# Altium project MCU152A.PrjPcb (part 1 of 3)
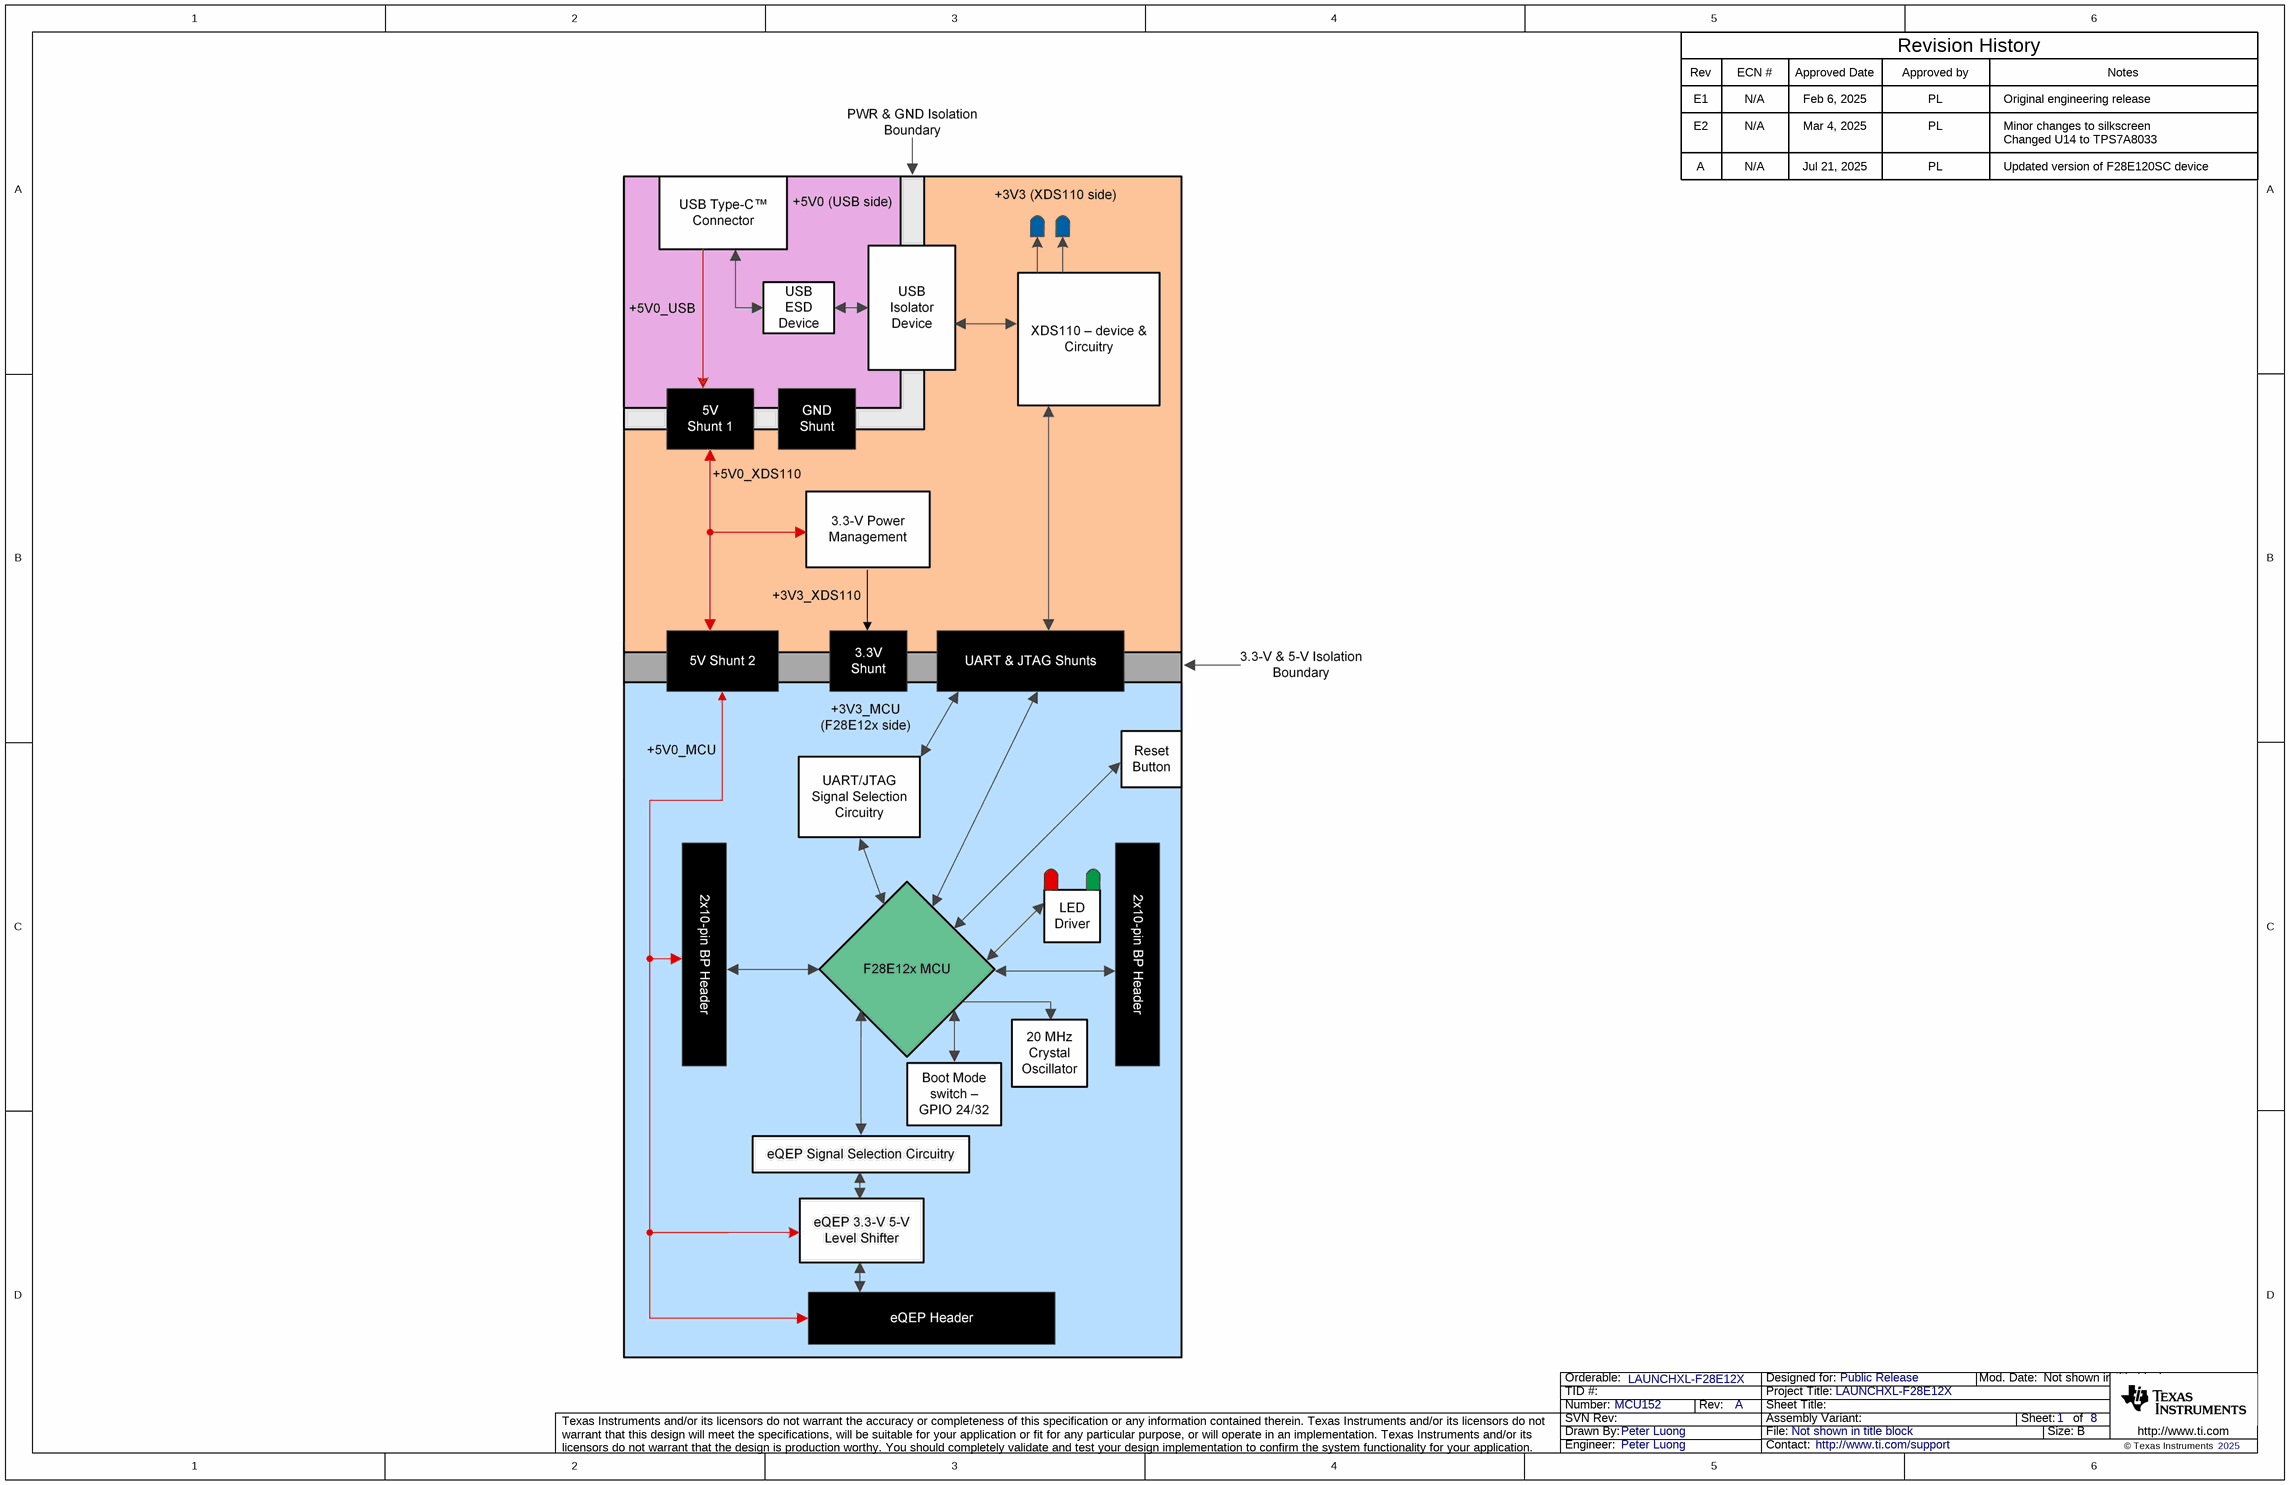
[diagram p0: MCU152A_Block_Diagram.SchDoc]
TechSupport: http://www.ti.com/support; SCH_Rev: A; PRJ_Title: LAUNCHXL-F28E12X; PRJ_Number: MCU152; PRJ_Engineer: Peter Luong; PRJ_Customer: Public Release; PCB_Rev: A; PCB_Layout: a0488298; EVM_orderable: LAUNCHXL-F28E12X; DrawnBy: Peter Luong; CopyrightYear: 2025
8 sheets, 199 parts. Net scope: global (net labels, ports and power ports of the same name join across sheets).
Board file: MCU152A.PcbDoc
Sheets:
  MCU152A_Block_Diagram.SchDoc
  MCU152A_Connectors.SchDoc
  MCU152A_AltRouting_Misc.SchDoc
  MCU152A_F28E12X_Device.SchDoc
  MCU152A_ADC.SchDoc
  MCU152A_USB_and_Power.SchDoc
  MCU152A_XDS110_MCU.SchDoc
  MCU152A_Hardware.SchDoc

## Sheet MCU152A_Block_Diagram.SchDoc
size 431 x 279 mm; Date: Not shown in title block; ApprovedBy: Not shown in title block; CheckedBy: Not shown in title block; Author: Not shown in title block; CompanyName: Not shown in title block; Engineer: Not shown in title block; Organization: Not shown in title block; Address1: Not shown in title block; Address2: Not shown in title block; Address3: Not shown in title block; Address4: Not shown in title block; DocumentNumber: 1; Revision: Use project parameter SCH_Rev; SheetNumber: 1; SheetTotal: 8; PageSetup: Record=PageOptions|CenterHorizontal=True|CenterVertical=True|PrintScale=1.00|XCorrection=1.00|YCorrection=1.00|PrintKind=0|BorderSize=5000000|LeftOffset=0|BottomOffset=0|Orientation=2|PaperLength=1000|PaperWidth=1000|Scale=100|PaperSource=15|PrintQuality=600|MediaType=1|DitherType=10|PaperKind=Letter|PrintScaleMode=1; CurrentTime: Not shown in title block; CurrentDate: Not shown in title block; Time: Not shown in title block; DocumentFullPathAndName: Not shown in title block; DocumentName: Not shown in title block; ModifiedDate: Not shown in title block; ImagePath: Not shown in title block

### Notes on the sheet
- Rev
- E1
- ECN #
- N/A
- Approved Date
- Feb 6, 2025
- Approved by
- PL
- Revision History
- Original engineering release
- Notes
- E2
- A
- Mar 4, 2025
- Jul 21, 2025
- Minor changes to silkscreen
- Changed U14 to TPS7A8033
- Updated version of F28E120SC device
- Drawn By:
- SVN Rev:
- Number:
- TID #:
- Orderable:
- Rev:
- Sheet Title:
- File:
- Project Title:
- Designed for:
- Assembly Variant:
- Mod. Date:
- Sheet:
- Size:
- of
- B
- http://www.ti.com
- Texas Instruments and/or its licensors do not warrant the accuracy or completeness of this specification or any information contained therein. Texas Instruments and/or its licensors do not warrant that this design will meet the specifications, will be suitable for your application or fit for any particular purpose, or will operate in an implementation. Texas Instruments and/or its licensors do not warrant that the design is production worthy. You should completely validate and test your design implementation to confirm the system functionality for your application.
- Engineer:
- Contact:
- © Texas Instruments

## Sheet MCU152A_Connectors.SchDoc
size 431 x 279 mm; Date: Not shown in title block; ApprovedBy: Not shown in title block; CheckedBy: Not shown in title block; Author: Not shown in title block; CompanyName: Not shown in title block; Engineer: Not shown in title block; Organization: Not shown in title block; Address1: Not shown in title block; Address2: Not shown in title block; Address3: Not shown in title block; Address4: Not shown in title block; DocumentNumber: 2; Revision: Use project parameter SCH_Rev; SheetNumber: 2; SheetTotal: 8; PageSetup: Record=PageOptions|CenterHorizontal=True|CenterVertical=True|PrintScale=1.00|XCorrection=1.00|YCorrection=1.00|PrintKind=0|BorderSize=5000000|LeftOffset=0|BottomOffset=0|Orientation=2|PaperLength=1000|PaperWidth=1000|Scale=100|PaperSource=15|PrintQuality=600|MediaType=1|DitherType=10|PaperKind=Letter|PrintScaleMode=1; CurrentTime: Not shown in title block; CurrentDate: Not shown in title block; Time: Not shown in title block; DocumentFullPathAndName: Not shown in title block; DocumentName: Not shown in title block; ModifiedDate: Not shown in title block; ImagePath: Not shown in title block
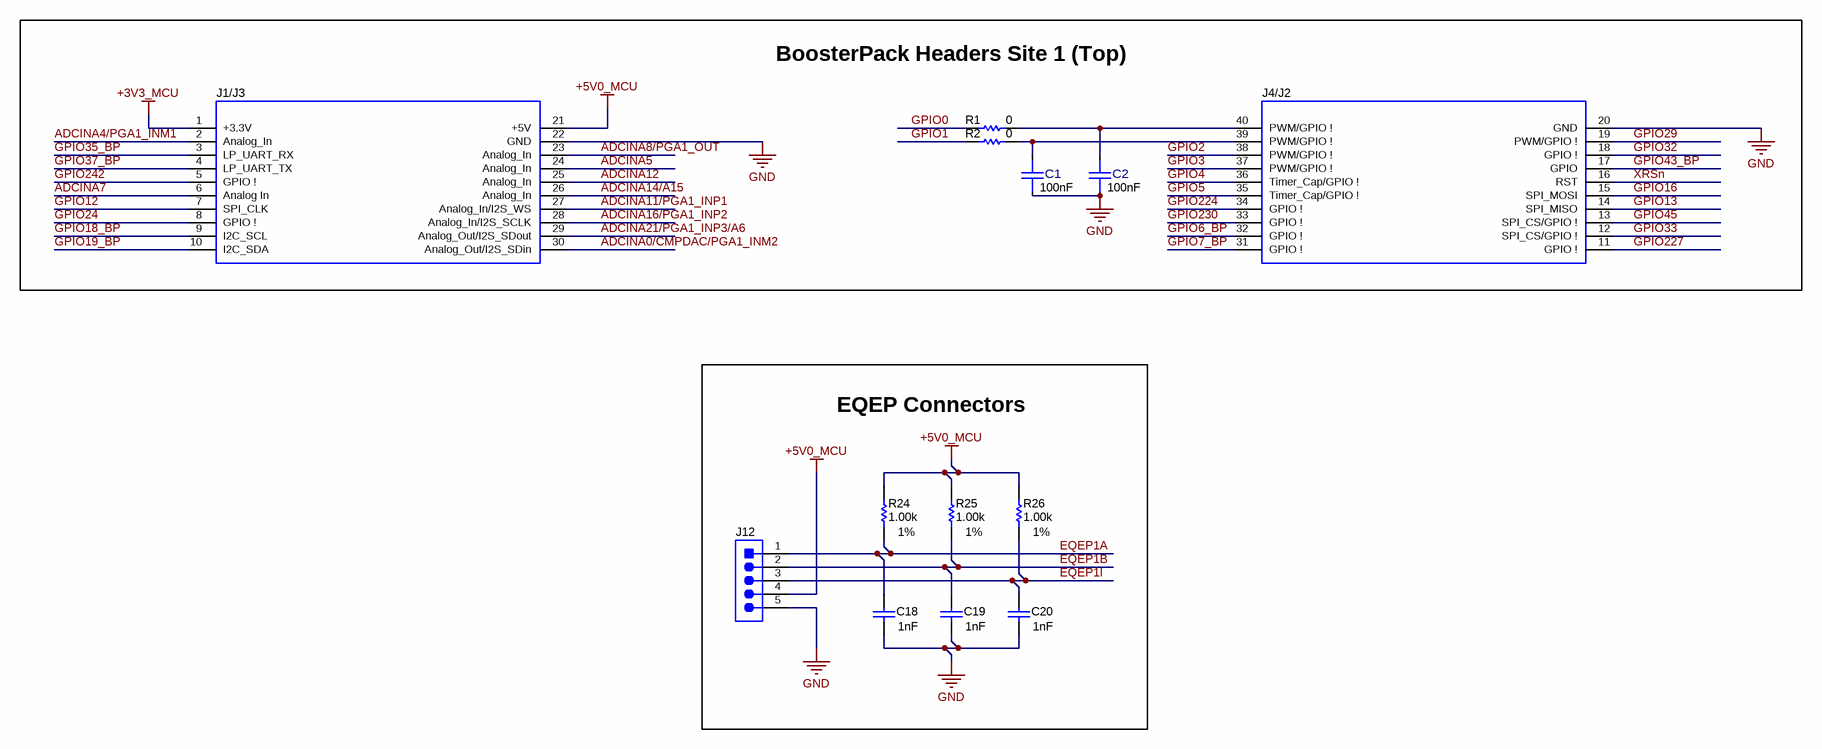
[diagram p1: MCU152A_Connectors.SchDoc]

### Parts
C1  Cap_F: 100nF  [FP-885012205018_0402-MFG]  (hidden comment: 885012205018)
C2  Cap_F: 100nF  [FP-885012205018_0402-MFG]  (hidden comment: 885012205018)
C18  Cap_F: 1nF  [0402]  (hidden comment: 885012205061)
C19  Cap_F: 1nF  [0402]  (hidden comment: 885012205061)
C20  Cap_F: 1nF  [0402]  (hidden comment: 885012205061)
J1/J3  SSQ-110-03-T-D  [BoosterPack_40pin_J1J3]  (value not drawn)
J4/J2  SSQ-110-03-T-D  [BoosterPack_40pin_J2J4]  (value not drawn)
J12  61300511121  [Wurth_61300511121]  (value not drawn)
R1  ValueDisplayed: 0  [0402]  (hidden comment: RC0402JR-070RL)
R2  ValueDisplayed: 0  [0402]  (hidden comment: RC0402JR-070RL)
R24  ValueDisplayed: 1.00k  Value1: 1%  [0402]  (hidden comment: CRCW04021K00FKED)
R25  ValueDisplayed: 1.00k  Value1: 1%  [0402]  (hidden comment: CRCW04021K00FKED)
R26  ValueDisplayed: 1.00k  Value1: 1%  [0402]  (hidden comment: CRCW04021K00FKED)

### Blocks framed on the sheet
BoosterPack Headers Site 1 (Top): C1 C2 J1/J3 J4/J2 R1 R2
EQEP Connectors: C18-C20 J12 R24-R26

### Nets
+3V3_MCU: J1/J3.1(+3.3V)
+5V0_MCU: J1/J3.21(+5V) J12.4 R24.2 R25.2 R26.2
GND: C1.1 C2.1 C18.2 C19.2 C20.2 J1/J3.22(GND) J4/J2.20(GND) J12.5
ADCINA0/CMPDAC/PGA1_INM2: J1/J3.30(Analog_Out/I2S_SDin)
ADCINA4/PGA1_INM1: J1/J3.2(Analog_In)
ADCINA5: J1/J3.24(Analog_In)
ADCINA7: J1/J3.6(Analog_In)
ADCINA8/PGA1_OUT: J1/J3.23(Analog_In)
ADCINA11/PGA1_INP1: J1/J3.27(Analog_In/I2S_WS)
ADCINA12: J1/J3.25(Analog_In)
ADCINA14/A15: J1/J3.26(Analog_In)
ADCINA16/PGA1_INP2: J1/J3.28(Analog_In/I2S_SCLK)
ADCINA21/PGA1_INP3/A6: J1/J3.29(Analog_Out/I2S_SDout)
EQEP1A: C18.1 J12.1 R24.1
EQEP1B: C19.1 J12.2 R25.1
EQEP1I: C20.1 J12.3 R26.1
GPIO0: R1.1
GPIO1: R2.1
GPIO2: J4/J2.38(PWM/GPIO_!)
GPIO3: J4/J2.37(PWM/GPIO_!)
GPIO4: J4/J2.36(Timer_Cap/GPIO_!)
GPIO5: J4/J2.35(Timer_Cap/GPIO_!)
GPIO6_BP: J4/J2.32(GPIO_!)
GPIO7_BP: J4/J2.31(GPIO_!)
GPIO12: J1/J3.7(SPI_CLK)
GPIO13: J4/J2.14(SPI_MISO)
GPIO16: J4/J2.15(SPI_MOSI)
GPIO18_BP: J1/J3.9(I2C_SCL)
GPIO19_BP: J1/J3.10(I2C_SDA)
GPIO24: J1/J3.8(GPIO_!)
GPIO29: J4/J2.19(PWM/GPIO_!)
GPIO32: J4/J2.18(GPIO_!)
GPIO33: J4/J2.12(SPI_CS/GPIO_!)
GPIO35_BP: J1/J3.3(LP_UART_RX)
GPIO37_BP: J1/J3.4(LP_UART_TX)
GPIO43_BP: J4/J2.17(GPIO)
GPIO45: J4/J2.13(SPI_CS/GPIO_!)
GPIO224: J4/J2.34(GPIO_!)
GPIO227: J4/J2.11(GPIO_!)
GPIO230: J4/J2.33(GPIO_!)
GPIO242: J1/J3.5(GPIO_!)
XRSn: J4/J2.16(RST)
NetC1_2: C1.2 J4/J2.39(PWM/GPIO_!) R2.2
NetC2_2: C2.2 J4/J2.40(PWM/GPIO_!) R1.2

### Notes on the sheet
- Drawn By:
- SVN Rev:
- Number:
- TID #:
- Orderable:
- Rev:
- Sheet Title:
- File:
- Project Title:
- Designed for:
- Assembly Variant:
- Mod. Date:
- Sheet:
- Size:
- of
- B
- http://www.ti.com
- Texas Instruments and/or its licensors do not warrant the accuracy or completeness of this specification or any information contained therein. Texas Instruments and/or its licensors do not warrant that this design will meet the specifications, will be suitable for your application or fit for any particular purpose, or will operate in an implementation. Texas Instruments and/or its licensors do not warrant that the design is production worthy. You should completely validate and test your design implementation to confirm the system functionality for your application.
- Engineer:
- Contact:
- © Texas Instruments

### Library data of the parts
C1 C2 = CMP-0090362-1: 0.1µF ±10% 10V Ceramic Capacitor X7R 0402 (1005 Metric); Manufacturer: Wurth Electronics; AEC Qualified: No; Value: 100nF; SizeZ_mm: 0.55mm; ValueDisplayed: 100000pF; TempCo: 15%; RoHS: TRUE; Tolerance_%: 10%; datasheet: https://www.we-online.com/catalog/datasheet/885012205018.pdf; Lead Free: Yes; Operating Temperature Range: -55°C to +125°C; ComponentLink1Description: Datasheet; Digikey Description: CAP CER 0.1UF 10V X7R 0402; Supplier Part Number 1: 732-7513-1-ND; Supplier 2: Mouser; Mouser Part Number: 710-885012205018; Digikey Part Number: 732-7513-1-ND; Temperature Characteristic: X7R; Supplier 1: Digikey; Datasheet Path: datasheets/Cap-885012205018.pdf; ComponentLink1URL: https://www.we-online.com/catalog/datasheet/885012205018.pdf; VDC_V: 10V; Supplier Part Number 2: 710-885012205018; PackageReference: 0402; PartNumber: 885012205018; Part Number: 885012205018; helpURL: https://upverter.com/upn/revision/1acbe355db19639d/
C18-C20 = CMP-0006231-2: CAP, CERM, 1000 pF, 50 V, +/- 10%, X7R, 0402; Manufacturer: Wurth Elektronik; Polarized: N; Value: 1000pF; U/M: EA; Value1: Unknown; VDC_V: 50V; TaMin_C: -55°C; TaMax_C: 125°C; SizeArea_mm2: 0.5; SizeAreaWB_mm2: 3; SizeX_mm: 1; SizeZ_mm: 0.6; AEC Category: Q200; CompType: Capacitor; PartNumber: 885012205061; ValueDisplayed: 1000pF; PackageReference: 0402; RoHS: Y; Tolerance_%: 10%; Value2: 50V; MountType: SMT; Technology: Ceramic; TempCo: X7R; Cap_Case: 0402; SizeY_mm: 0.5; Published: 2008-06-19; Publisher: Texas Instruments; LatestRevisionDate: 2017-03-09; ComponentLink1Description: Datasheet link; ComponentLink1URL: http://katalog.we-online.de/pbs/datasheet/885012205061.pdf; Supplier 1: Digi-Key; Supplier Part Number 1: 732-7556-1-ND; Supplier 2: Mouser; Supplier Part Number 2: 710-885012205061; AEC Qualified: N; AEC Grade: N/A
J1/J3 = CMP-0003837-4: Receptacle, 2.54mm, 10x2, Tin, TH; Alternate PartNumber: CRD-081413-A-G; Manufacturer: Samtec; Alternate Manufacturer: Major League Electronics; Note: Booster Pack 40 pin J1 and J3; Green_Lifecycle: Active; Green_REACh: Incomplete; Supplier 1: Digi-Key; CompType: Receptacle; PackageReference: 10x2 Receptacle; RoHS: Y; Supplier Part Number 1: SAM1204-10-ND; MountType: TH; PartNumber: SSQ-110-03-T-D; ComponentLink1Description: Datasheet Link; ComponentLink1URL: https://www.samtec.com/ftppub/cpdf/SSQ-1XX-XX-XXX-X-XX-XXX-XX-X-MKT.pdf; Supplier 2: Newark; Supplier Part Number 2: 11P8392; Green_EU RoHS: Passed; Green_EU RoHS-2: Passed
J4/J2 = CMP-0078266-4: Receptacle, 2.54mm, 10x2, Tin, TH; Alternate PartNumber: CRD-081413-A-G; Manufacturer: Samtec; Alternate Manufacturer: Major League Electronics; Note: Booster Pack 40 pin J2 and J4; Green_REACh: Incomplete; Green_Lifecycle: Active; Green_EU RoHS-2: Passed; CompType: Receptacle; Supplier 1: Digi-Key; PackageReference: 10x2 Receptacle; RoHS: Y; Supplier Part Number 1: SAM1204-10-ND; PartNumber: SSQ-110-03-T-D; MountType: TH; ComponentLink1Description: Datasheet Link; Green_EU RoHS: Passed; ComponentLink1URL: https://www.samtec.com/ftppub/cpdf/SSQ-1XX-XX-XXX-X-XX-XXX-XX-X-MKT.pdf; Supplier 2: Newark; Supplier Part Number 2: 11P8392
J12 = CMP-0084909-1: Header, 2.54mm, 5x1, Gold, TH; Manufacturer: Wurth Elektronik; Pitch_mm: 2.54; Gender: Male; Row_Count: 1; Shrouded: N; Current_A: 3A; Voltage_V: 250V; Color: Black; PinCount: 5; ContactFinish: Gold; ComponentLink1URL: https://katalog.we-online.de/em/datasheet/6130xx11121.pdf; ComponentLink1Description: Datasheet URL; CompType: Header; MountType: TH; PartNumber: 61300511121; RoHS: Y; PackageReference: Header, 2.54mm, 5x1, TH; ClassName: Header; Orientation: Vertical
R1 R2 = CMP-0027004-2: RES, 0, 5%, 0.063 W, 0402; Manufacturer: Yageo America; Power_W: 63mW; TempCo: 200 ppm/C; Value_Code: 0000; U/M: EA; Value: 0; EIA_Code: E24; SizeX_mm: 1; SizeY_mm: 0.5; SizeZ_mm: 0.6; Value2: 0.063W; VDC_V: 50V; AEC Category: Q200; Supplier Part Number 2: 603-RC0402JR-070RL; Publisher: Texas Instruments; Supplier 2: Mouser; Supplier Part Number 3: 9232516; Supplier 3: Farnell; Published: 2008-06-26; RoHS: Y; Value1: 5%; MountType: SMT; Supplier 1: Digi-Key; PackageReference: 0402; Tolerance_%: 5%; Res_ohm: 0; SizeArea_mm2: 0.5; CompType: Resistor; LatestRevisionDate: 2017-03-09; PartNumber: RC0402JR-070RL; AEC Qualified: ?; ComponentLink1Description: Datasheet link; Supplier Part Number 1: 311-0.0JRCT-ND; Technology: Thick Film; ComponentLink1URL: http://www.yageo.com/pdf/Pu-RC0402_51_PbFree_L_2.pdf
R24-R26 = CMP-0026071-3: RES, 1.00 k, 1%, 0.063 W, AEC-Q200 Grade 0, 0402; Manufacturer: Vishay-Dale; Value: 1.00k; Res_ohm: 1k; Value_Code: 1k00; Power_W: 63mW; Value2: 0.063W; VDC_V: 50V; TempCo: 100 ppm/C; SizeArea_mm2: 0.5; SizeX_mm: 1; SizeZ_mm: 0.6; EIA_Code: E96; AEC Category: Q200; AEC Qualified: Y; AEC Grade: 0; CompType: Resistor; PartNumber: CRCW04021K00FKED; PackageReference: 0402; RoHS: E; Tolerance_%: 1%; MountType: SMT; Technology: Thick Film; SizeY_mm: 0.5; ComponentLink1Description: Datasheet link; ComponentLink1URL: http://www.vishay.com/docs/20035/dcrcwe3.pdf; Supplier 1: Digi-Key; Supplier Part Number 1: 541-1.00KLCT-ND; Supplier 2: Newark; Supplier Part Number 2: 52K6545; Supplier 3: Mouser; Supplier Part Number 3: 71-CRCW0402-1.0K-E3

## Sheet MCU152A_AltRouting_Misc.SchDoc
size 431 x 279 mm; Date: Not shown in title block; ApprovedBy: Not shown in title block; CheckedBy: Not shown in title block; Author: Not shown in title block; CompanyName: Not shown in title block; Engineer: Not shown in title block; Organization: Not shown in title block; Address1: Not shown in title block; Address2: Not shown in title block; Address3: Not shown in title block; Address4: Not shown in title block; DocumentNumber: 3; Revision: Use project parameter SCH_Rev; SheetNumber: 3; SheetTotal: 8; PageSetup: Record=PageOptions|CenterHorizontal=True|CenterVertical=True|PrintScale=1.00|XCorrection=1.00|YCorrection=1.00|PrintKind=0|BorderSize=5000000|LeftOffset=0|BottomOffset=0|Orientation=2|PaperLength=1000|PaperWidth=1000|Scale=100|PaperSource=15|PrintQuality=600|MediaType=1|DitherType=10|PaperKind=Letter|PrintScaleMode=1; CurrentTime: Not shown in title block; CurrentDate: Not shown in title block; Time: Not shown in title block; DocumentFullPathAndName: Not shown in title block; DocumentName: Not shown in title block; ModifiedDate: Not shown in title block; ImagePath: Not shown in title block
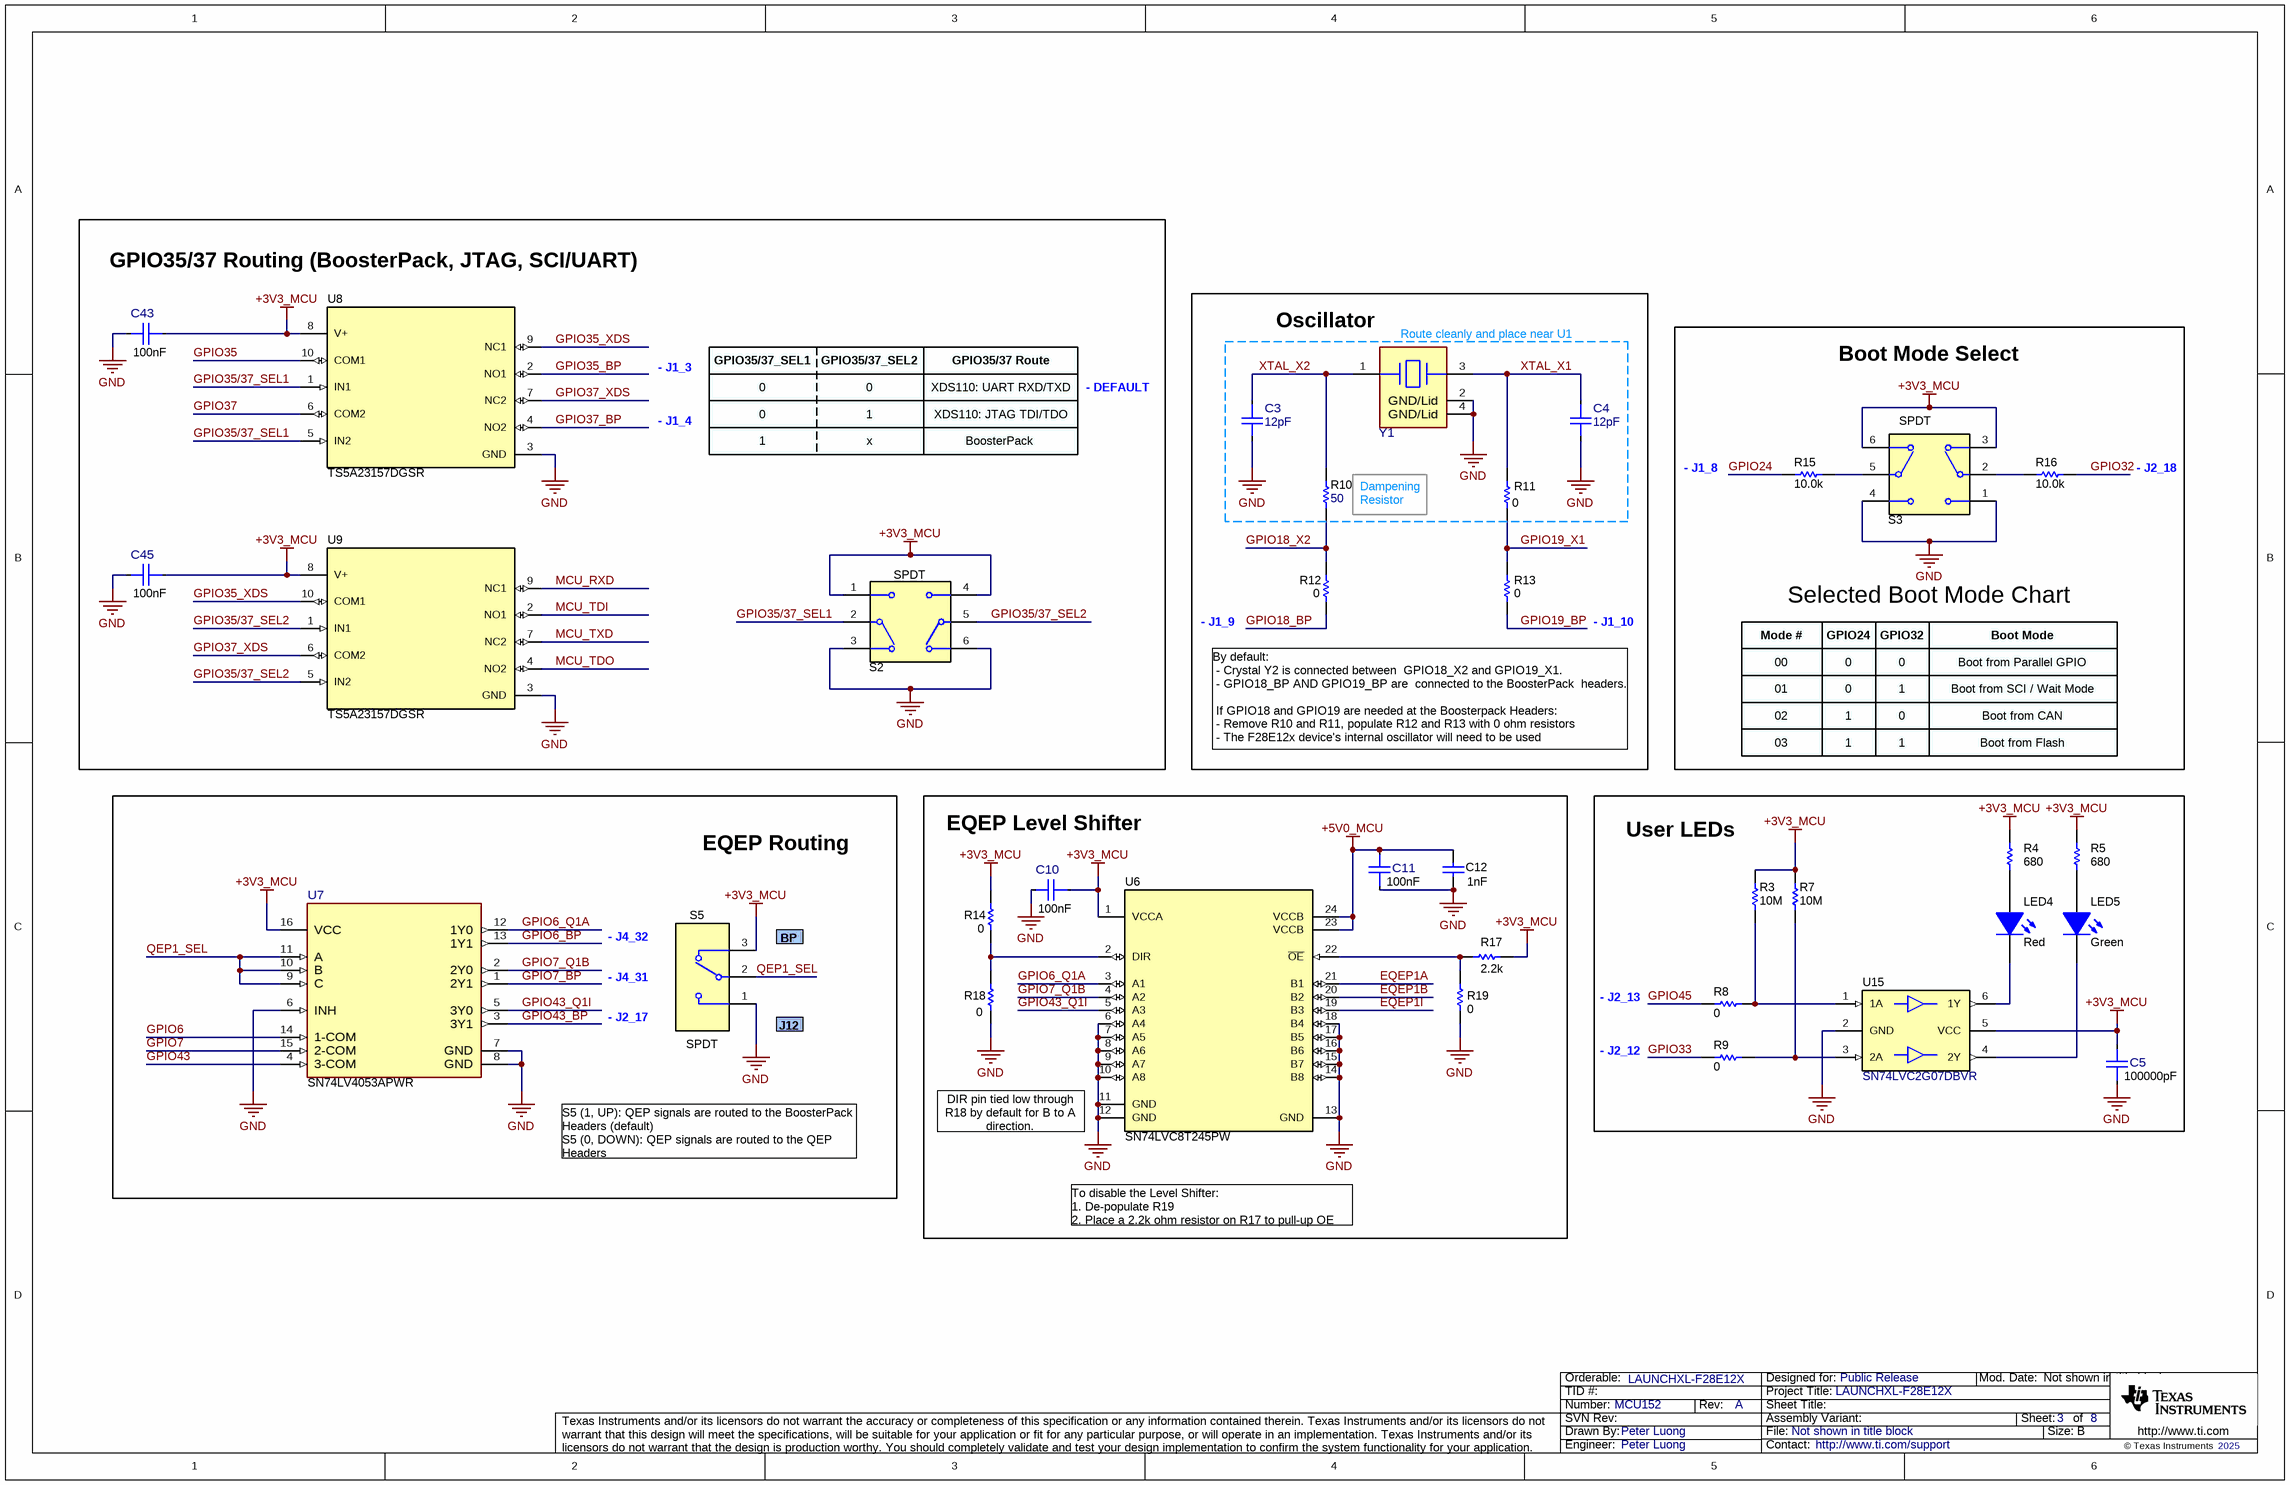
[diagram p2: MCU152A_AltRouting_Misc.SchDoc]

### Parts
C3  ValueDisplayed: 12pF  [FP-885392005127_0402-MFG]  (hidden comment: 885392005127)
C4  ValueDisplayed: 12pF  [FP-885392005127_0402-MFG]  (hidden comment: 885392005127)
C5  ValueDisplayed: 100000pF  [FP-885012205018_0402-MFG]  (hidden comment: 885012205018)
C10  Cap_F: 100nF  [FP-885012205018_0402-MFG]  (hidden comment: 885012205018)
C11  Cap_F: 100nF  [FP-885012205018_0402-MFG]  (hidden comment: 885012205018)
C12  Cap_F: 1nF  [0402]  (hidden comment: 885012205061)
C43  Cap_F: 100nF  [FP-885012205018_0402-MFG]  (hidden comment: 885012205018)
C45  Cap_F: 100nF  [FP-885012205018_0402-MFG]  (hidden comment: 885012205018)
LED4  value Red  [WL-SMCW_RED_0805]  (hidden comment: 150080SS75000)
LED5  value Green  [WL-SMCW_Green_0805]  (hidden comment: 150080GS75000)
R3  ValueDisplayed: 10M  [0402]  (hidden comment: CRCW040210M0JNED)
R4  ValueDisplayed: 680  [0402]  (hidden comment: CRCW0402680RJNED)
R5  ValueDisplayed: 680  [0402]  (hidden comment: CRCW0402680RJNED)
R7  ValueDisplayed: 10M  [0402]  (hidden comment: CRCW040210M0JNED)
R8  ValueDisplayed: 0  [0603]  (hidden comment: CRCW06030000Z0EA)
R9  ValueDisplayed: 0  [0603]  (hidden comment: CRCW06030000Z0EA)
R10  ValueDisplayed: 50  [0603]  (hidden comment: FC0603E50R0BTBST1)
R11  ValueDisplayed: 0  [0603]  (hidden comment: CRCW06030000Z0EA)
R12  ValueDisplayed: 0  [0603]  (hidden comment: CRCW06030000Z0EA)
R13  ValueDisplayed: 0  [0603]  (hidden comment: CRCW06030000Z0EA)
R14  ValueDisplayed: 0  [0603]  (hidden comment: CRCW06030000Z0EA)
R15  ValueDisplayed: 10.0k  [0603]  (hidden comment: RC0603FR-0710KL)
R16  ValueDisplayed: 10.0k  [0603]  (hidden comment: RC0603FR-0710KL)
R17  ValueDisplayed: 2.2k  [0603]  (hidden comment: CRCW06032K20JNEA)
R18  ValueDisplayed: 0  [0603]  (hidden comment: CRCW06030000Z0EA)
R19  ValueDisplayed: 0  [0603]  (hidden comment: CRCW06030000Z0EA)
S2  CAS-D20TA  [SW_CAS-D20TA]  (value not drawn)
S3  CAS-D20TA  [SW_CAS-D20TA]  (value not drawn)
S5  CAS-120TA  [SW_CAS-120TA]  (value not drawn)
U6  SN74LVC8T245PW  [PW0024A_N]
U7  SN74LV4053APWR  [PW0016A-MFG]
U8  TS5A23157DGSR  [DGS0010A_N]
U9  TS5A23157DGSR  [DGS0010A_N]
U15  SN74LVC2G07DBVR  [DBV0006A_N]
Y1  830108207209  [FP-830108207209_SMT_CRYSTAL_3MM2_2MM5-MFG]  (value not drawn)

### Blocks framed on the sheet
GPIO35/37 Routing (BoosterPack, JTAG, SCI/UART): C43 C45 S2 U8 U9
Oscillator: C3 C4 R10-R13 Y1
Selected Boot Mode Chart: R15 R16 S3
EQEP Routing: S5 U7
EQEP Level Shifter: C10-C12 R14 R17-R19 U6
User LEDs: C5 LED4 LED5 R3-R5 R7-R9 U15

### Nets
+3V3_MCU: C5.2 C10.1 C43.1 C45.1 R3.2 R4.2 R5.2 R7.2 R14.2 R17.2 S2.1 S2.4 S3.3 S3.6 S5.3 U6.1(VCCA) U7.16(VCC) U8.8(V+) U9.8(V+) U15.5(VCC)
+5V0_MCU: C11.2 C12.1 U6.23(VCCB) U6.24(VCCB)
GND: C3.2 C4.2 C5.1 C10.2 C11.1 C12.2 C43.2 C45.2 R18.1 R19.2 S2.3 S2.6 S3.1 S3.4 S5.1 U6.6(A4) U6.7(A5) U6.8(A6) U6.9(A7) U6.10(A8) U6.11(GND) U6.12(GND) U6.13(GND) U6.14(B8) U6.15(B7) U6.16(B6) U6.17(B5) U6.18(B4) U7.6(INH) U7.7(GND) U7.8(GND) U8.3(GND) U9.3(GND) U15.2(GND) Y1.2(GND/Lid) Y1.4(GND/Lid)
EQEP1A: U6.21(B1)
EQEP1B: U6.20(B2)
EQEP1I: U6.19(B3)
GPIO6: U7.14(1-COM)
GPIO6_BP: U7.13(1Y1)
GPIO6_Q1A: U6.3(A1) U7.12(1Y0)
GPIO7: U7.15(2-COM)
GPIO7_BP: U7.1(2Y1)
GPIO7_Q1B: U6.4(A2) U7.2(2Y0)
GPIO18_BP: R12.1
GPIO18_X2: R10.1 R12.2
GPIO19_BP: R13.1
GPIO19_X1: R11.1 R13.2
GPIO24: R15.1
GPIO32: R16.2
GPIO33: R9.1
GPIO35: U8.10(COM1)
GPIO35/37_SEL1: S2.2(C) U8.1(IN1) U8.5(IN2)
GPIO35/37_SEL2: S2.5(C) U9.1(IN1) U9.5(IN2)
GPIO35_BP: U8.2(NO1)
GPIO35_XDS: U8.9(NC1) U9.10(COM1)
GPIO37: U8.6(COM2)
GPIO37_BP: U8.4(NO2)
GPIO37_XDS: U8.7(NC2) U9.6(COM2)
GPIO43: U7.4(3-COM)
GPIO43_BP: U7.3(3Y1)
GPIO43_Q1I: U6.5(A3) U7.5(3Y0)
GPIO45: R8.1
MCU_RXD: U9.9(NC1)
MCU_TDI: U9.2(NO1)
MCU_TDO: U9.4(NO2)
MCU_TXD: U9.7(NC2)
QEP1_SEL: S5.2 U7.9(C) U7.10(B) U7.11(A)
XTAL_X1: C4.1 R11.2 Y1.3(2_Crystal)
XTAL_X2: C3.1 R10.2 Y1.1(1_Crystal)
NetLED4_1: LED4.1(K) U15.6(1Y)
NetLED4_2: LED4.2(A) R4.1
NetLED5_1: LED5.1(K) U15.4(2Y)
NetLED5_2: LED5.2(A) R5.1
NetR3_1: R3.1 R8.2 U15.1(1A)
NetR7_1: R7.1 R9.2 U15.3(2A)
NetR14_1: R14.1 R18.2 U6.2(DIR)
NetR15_2: R15.2 S3.5(C)
NetR16_1: R16.1 S3.2(C)
NetR17_1: R17.1 R19.1 U6.22(~{OE})

### Notes on the sheet
- - J1_3
- GPIO35/37_SEL1
- GPIO35/37_SEL2
- GPIO35/37 Route
- (near Y1) Route cleanly and place near U1
- Boot Mode Select
- - J1_4
- 0
- 1
- x
- BoosterPack
- XDS110: UART RXD/TXD
- XDS110: JTAG TDI/TDO
- - DEFAULT
- (near S3) SPDT
- (near R10) Dampening
- - J1_8
- - J2_18
- (near S2) SPDT
- (near R10) Resistor
- - J1_9
- - J1_10
- Mode #
- GPIO24
- GPIO32
- Boot Mode
- 00
- 01
- Boot from Parallel GPIO
- Boot from SCI / Wait Mode
- By default:
  - Crystal Y2 is connected between  GPIO18_X2 and GPIO19_X1.
  - GPIO18_BP AND GPIO19_BP are  connected to the BoosterPack  headers.
  If GPIO18 and GPIO19 are needed at the Boosterpack Headers:
  - Remove R10 and R11, populate R12 and R13 with 0 ohm resistors
  - The F28E12x device's internal oscillator will need to be used
- 02
- 03
- Boot from CAN
- Boot from Flash
- - J4_32
- - J4_31
- (near S5) BP
- - J2_17
- (near S5) J12
- - J2_13
- (near S5) SPDT
- - J2_12
- S5 (1, UP): QEP signals are routed to the BoosterPack Headers (default)
  S5 (0, DOWN): QEP signals are routed to the QEP Headers
- (near U6) DIR pin tied low through R18 by default for B to A direction.
- To disable the Level Shifter:
  1. De-populate R19
  2. Place a 2.2k ohm resistor on R17 to pull-up OE
- Drawn By:
- SVN Rev:
- Number:
- TID #:
- Orderable:
- Rev:
- Sheet Title:
- File:
- Project Title:
- Designed for:
- Assembly Variant:
- Mod. Date:
- Sheet:
- Size:
- of
- B
- http://www.ti.com
- Texas Instruments and/or its licensors do not warrant the accuracy or completeness of this specification or any information contained therein. Texas Instruments and/or its licensors do not warrant that this design will meet the specifications, will be suitable for your application or fit for any particular purpose, or will operate in an implementation. Texas Instruments and/or its licensors do not warrant that the design is production worthy. You should completely validate and test your design implementation to confirm the system functionality for your application.
- Engineer:
- Contact:
- © Texas Instruments

### Library data of the parts
C3 C4 = CMP-0124909-1: 12 pF ±2% 50V Ceramic Capacitor C0G, NP0 0402 (1005 Metric); Manufacturer: Wurth; AEC Qualified: No; SizeZ_mm: 0.55mm; TempCo: 30ppm/°C; Value: 12pF; Cap_F: 12pF; PackageReference: 0402; PartNumber: 885392005127; RoHS: TRUE; Supplier 1: Digikey; Supplier 2: Mouser; Supplier Part Number 1: 732-885392005127CT-ND; Supplier Part Number 2: 710-885392005127; Tolerance_%: 2%; VDC_V: 50V; Part Number: 885392005127; datasheet: https://www.we-online.com/components/products/datasheet/885392005127.pdf; Datasheet Date: 2020-04-15; Datasheet Path: datasheets/Cap-885392005127.pdf; Datasheet Version: 001.000; Digikey Description: WCAP-CSRF HIGH FREQUENCY MLCC SM; Digikey Part Number: 732-885392005127CT-ND; helpURL: https://upverter.com/upn/revision/f0bec071446ecf6a/; Lead Free: Yes; Mouser Description: WCAP-CSRF High Frequency MLCC; Mouser Part Number: 710-885392005127; Operating Temperature Range: -55°C to +125°C; Temperature Characteristic: NP0; ComponentLink1Description: Datasheet; ComponentLink1URL: https://www.we-online.com/components/products/datasheet/885392005127.pdf
C5 = CMP-0090362-1: 0.1µF ±10% 10V Ceramic Capacitor X7R 0402 (1005 Metric); Manufacturer: Wurth Electronics; AEC Qualified: No; Value: 100nF; SizeZ_mm: 0.55mm; TempCo: 15%; RoHS: TRUE; Tolerance_%: 10%; datasheet: https://www.we-online.com/catalog/datasheet/885012205018.pdf; Lead Free: Yes; Operating Temperature Range: -55°C to +125°C; ComponentLink1Description: Datasheet; Digikey Description: CAP CER 0.1UF 10V X7R 0402; Supplier Part Number 1: 732-7513-1-ND; Supplier 2: Mouser; Mouser Part Number: 710-885012205018; Digikey Part Number: 732-7513-1-ND; Temperature Characteristic: X7R; Supplier 1: Digikey; Datasheet Path: datasheets/Cap-885012205018.pdf; ComponentLink1URL: https://www.we-online.com/catalog/datasheet/885012205018.pdf; VDC_V: 10V; Supplier Part Number 2: 710-885012205018; Cap_F: 100nF; PackageReference: 0402; PartNumber: 885012205018; Part Number: 885012205018; helpURL: https://upverter.com/upn/revision/1acbe355db19639d/
C10 C11 C43 C45 = CMP-0090362-1: as C1 on sheet MCU152A_Connectors; RoHS: TRUE; Tolerance_%: 10%; datasheet: https://www.we-online.com/catalog/datasheet/885012205018.pdf; Lead Free: Yes; Operating Temperature Range: -55°C to +125°C; ComponentLink1Description: Datasheet; Digikey Description: CAP CER 0.1UF 10V X7R 0402; Supplier Part Number 1: 732-7513-1-ND; Supplier 2: Mouser; Mouser Part Number: 710-885012205018; Digikey Part Number: 732-7513-1-ND; Temperature Characteristic: X7R; Supplier 1: Digikey; Datasheet Path: datasheets/Cap-885012205018.pdf; ComponentLink1URL: https://www.we-online.com/catalog/datasheet/885012205018.pdf; VDC_V: 10V; Supplier Part Number 2: 710-885012205018; PackageReference: 0402; PartNumber: 885012205018; Part Number: 885012205018; helpURL: https://upverter.com/upn/revision/1acbe355db19639d/
C12 = CMP-0006231-2: as C18 on sheet MCU152A_Connectors; CompType: Capacitor; PartNumber: 885012205061; ValueDisplayed: 1000pF; PackageReference: 0402; RoHS: Y; Tolerance_%: 10%; Value2: 50V; MountType: SMT; Technology: Ceramic; TempCo: X7R; Cap_Case: 0402; SizeY_mm: 0.5; Published: 2008-06-19; Publisher: Texas Instruments; LatestRevisionDate: 2017-03-09; ComponentLink1Description: Datasheet link; ComponentLink1URL: http://katalog.we-online.de/pbs/datasheet/885012205061.pdf; Supplier 1: Digi-Key; Supplier Part Number 1: 732-7556-1-ND; Supplier 2: Mouser; Supplier Part Number 2: 710-885012205061; AEC Qualified: N; AEC Grade: N/A
LED4 = CMP-0002951-3: LED, Red, SMD; Manufacturer: Wurth Elektronik; Type: AlInGaP; Vf_V: 1.9V; Io_A: 30mA; Vr_V: 5V; Ir_A: 25µA; Tjmax_C: 85°C; Power_TotalModule: 72mW; Value1: 0.072W; Angle: 140; CompType: LED; PartNumber: 150080SS75000; MountType: SMT; RoHS: Y; PackageReference: LED_0805; Value2: 1.9V; Color: Red; ComponentLink1URL: http://katalog.we-online.de/led/datasheet/150080SS75000.pdf; ComponentLink1Description: Datasheet link
LED5 = CMP-0003014-3: LED, Green, SMD; Manufacturer: Wurth Elektronik; Io_A: 20mA; Ir_A: 10µA; Angle: 140; Power_TotalModule: 105mW; Type: InGaN; Vf_V: 3.2V; Tjmax_C: 85°C; Value1: 0.105W; Vr_V: 5V; RoHS: Y; CompType: LED; Color: Green; PartNumber: 150080GS75000; ComponentLink1URL: http://katalog.we-online.de/led/datasheet/150080GS75000.pdf; ComponentLink1Description: Datasheet link; PackageReference: LED_0805; MountType: SMT; Value2: 3.2V
R3 R7 = CMP-0026826-2: RES, 10 M, 5%, 0.063 W, AEC-Q200 Grade 0, 0402; Manufacturer: Vishay-Dale; Value: 10Meg; Value_Code: 10M0; Power_W: 63mW; Value2: 0.063W; VDC_V: 50V; TempCo: 200 ppm/C; SizeArea_mm2: 0.5; SizeX_mm: 1; SizeZ_mm: 0.6; EIA_Code: E24; AEC Category: Q200; AEC Qualified: Y; AEC Grade: 0; CompType: Resistor; PartNumber: CRCW040210M0JNED; PackageReference: 0402; RoHS: E; Res_ohm: 10M; Tolerance_%: 5%; Value1: 5%; MountType: SMT; Technology: Thick Film; SizeY_mm: 0.5; ComponentLink1Description: Datasheet link; ComponentLink1URL: http://www.vishay.com/docs/20035/dcrcwe3.pdf; Supplier 1: Digi-Key; Supplier Part Number 1: 541-10MJCT-ND; Supplier 2: Newark; Supplier Part Number 2: 59M6697; Supplier 3: Mouser; Supplier Part Number 3: 71-CRCW0402J-10M-E3
R4 R5 = CMP-0026962-3: RES, 680, 5%, 0.063 W, AEC-Q200 Grade 0, 0402; Manufacturer: Vishay-Dale; Power_W: 63mW; TempCo: 200 ppm/C; Value_Code: 680R; Value: 680; EIA_Code: E24; SizeX_mm: 1; SizeY_mm: 0.5; SizeZ_mm: 0.6; Value2: 0.063W; AEC Qualified: Y; VDC_V: 50V; AEC Category: Q200; AEC Grade: 0; Supplier Part Number 2: 59M6744; Supplier 2: Newark; Supplier Part Number 3: 71-CRCW0402J-680-E3; Supplier 3: Mouser; RoHS: E; Value1: 5%; MountType: SMT; Supplier 1: Digi-Key; PackageReference: 0402; Tolerance_%: 5%; Res_ohm: 680; SizeArea_mm2: 0.5; CompType: Resistor; PartNumber: CRCW0402680RJNED; ComponentLink1Description: Datasheet link; Supplier Part Number 1: 541-680JCT-ND; Technology: Thick Film; ComponentLink1URL: http://www.vishay.com/docs/20035/dcrcwe3.pdf
R8 R9 R11-R14 R18 R19 = CMP-0025697-4: RES, 0, 5%, 0.1 W, AEC-Q200 Grade 0, 0603; Manufacturer: Vishay-Dale; Value: 0; Value_Code: 0000; Power_W: 100mW; Value2: 0.1W; VDC_V: 75V; TempCo: 200 ppm/C; SizeArea_mm2: 1.28; SizeX_mm: 1.6; SizeY_mm: 0.8; SizeZ_mm: 1; EIA_Code: E24; AEC Category: Q200; AEC Qualified: Y; CompType: Resistor; PartNumber: CRCW06030000Z0EA; PackageReference: 0603; RoHS: E; Res_ohm: 0; Tolerance_%: 5%; Value1: 5%; MountType: SMT; Technology: Thick Film; ComponentLink1Description: Datasheet link; ComponentLink1URL: http://www.vishay.com/docs/20035/dcrcwe3.pdf; Supplier 1: Digi-Key; Supplier Part Number 1: 541-0.0GCT-ND; Supplier 2: Newark; Supplier Part Number 2: 52K8014; Supplier 3: Mouser; Supplier Part Number 3: 71-CRCW0603-0-E3; AEC Grade: 0
R10 = CMP-0023387-3: RES, 50, 0.1%, 0.125 W, 0603; Manufacturer: Vishay Thin Film; Power_W: 125mW; TempCo: 25 ppm/C; Value_Code: 50R0; U/M: EA; Value: 50; SizeX_mm: 1.6; SizeY_mm: 0.8; SizeZ_mm: 1; Value2: 0.125W; SizeArea_mm2: 1.28; AEC Qualified: N; VDC_V: 50V; AEC Category: Q200; Supplier Part Number 2: 41R5816; Publisher: Texas Instruments; Supplier 2: Newark; Supplier Part Number 3: 71-FC0603E50R0BTBST1; Supplier 3: Mouser; Published: 2008-06-26; RoHS: Y; Value1: 0.1%; MountType: SMT; Supplier 1: Digi-Key; PackageReference: 0603; Tolerance_%: 0.1%; Res_ohm: 50; CompType: Resistor; LatestRevisionDate: 2017-03-09; PartNumber: FC0603E50R0BTBST1; ComponentLink1Description: Datasheet link; AEC Grade: N/A; Supplier Part Number 1: FC0603-50BFCT-ND; Technology: Thin Film; ComponentLink1URL: http://www.vishay.com/docs/60093/fcseries.pdf
R15 R16 = CMP-0022746-5: RES, 10.0 k, 1%, 0.1 W, 0603; Manufacturer: Yageo; Power_W: 100mW; TempCo: 100 ppm/C; Value_Code: 10k0; Value: 10.0k; EIA_Code: E96; Res_ohm: 10k; SizeX_mm: 1.6; SizeY_mm: 0.8; SizeZ_mm: 1; Value2: 0.1W; SizeArea_mm2: 1.28; AEC Qualified: N; VDC_V: 75V; AEC Category: Q200; SizeAreaWB_mm2: 4.68; Supplier Part Number 2: 603-RC0603FR-0710KL; Supplier 2: Mouser; Supplier Part Number 3: 9238603; Supplier 3: Farnell; RoHS: Y; Value1: 1%; MountType: SMT; Supplier 1: Digi-Key; PackageReference: 0603; Tolerance_%: 1%; CompType: Resistor; PartNumber: RC0603FR-0710KL; ComponentLink1Description: Datasheet link; Supplier Part Number 1: 311-10.0KHRCT-ND; Technology: Thick Film; ComponentLink1URL: http://www.yageo.com/pdf/Pu-RC0603_51_PbFree_L_2.pdf; AEC Grade: N/A
R17 = CMP-0025769-4: RES, 2.2 k, 5%, 0.1 W, AEC-Q200 Grade 0, 0603; Manufacturer: Vishay-Dale; Value: 2.2k; Value_Code: 2k20; Power_W: 100mW; Value2: 0.1W; VDC_V: 75V; TempCo: 200 ppm/C; SizeArea_mm2: 1.28; SizeX_mm: 1.6; SizeY_mm: 0.8; SizeZ_mm: 1; EIA_Code: E24; AEC Category: Q200; AEC Qualified: Y; AEC Grade: 0; CompType: Resistor; PartNumber: CRCW06032K20JNEA; PackageReference: 0603; RoHS: E; Res_ohm: 2.2k; Tolerance_%: 5%; Value1: 5%; MountType: SMT; Technology: Thick Film; ComponentLink1Description: Datasheet link; ComponentLink1URL: http://www.vishay.com/docs/20035/dcrcwe3.pdf; Supplier 1: Digi-Key; Supplier Part Number 1: 541-2.2KGCT-ND; Supplier 2: Newark; Supplier Part Number 2: 59M6776; Supplier 3: Farnell; Supplier Part Number 3: 1652868
S2 = CMP-0002233-1: Switch, Dual SPDT,  2 Pos, 0.1A, 6VDC, SMD; Manufacturer: Copal Electronics; VDC_V: 6V; SwitchFunction: On-On; PositionCount: 2; CurrentRating_mA: 100A; PartNumber: CAS-D20TA; MountType: SMT; ComponentLink1Description: Datasheet Link; ComponentLink1URL: http://www.nidec-copal-electronics.com/e/catalog/switch/cas.pdf; RoHS: Y; Circuit: SPDT; Orientation: Top Actuated; CompType: Switch; PackageReference: 5.4x3.9mm; Publisher: Texas Instruments; LatestRevisionDate: 2017-03-09; Supplier 1: Digi-Key; Supplier Part Number 1: CASD20JCT-ND
S3 = CMP-0002233-1: Switch, Dual SPDT,  2 Pos, 0.1A, 6VDC, SMD; Manufacturer: Copal Electronics; CurrentRating_mA: 100A; SwitchFunction: On-On; VDC_V: 6V; PositionCount: 2; ComponentLink1Description: Datasheet Link; LatestRevisionDate: 2017-03-09; PackageReference: 5.4x3.9mm; Publisher: Texas Instruments; Supplier 1: Digi-Key; ComponentLink1URL: http://www.nidec-copal-electronics.com/e/catalog/switch/cas.pdf; Supplier Part Number 1: CASD20JCT-ND; MountType: SMT; Circuit: SPDT; Orientation: Top Actuated; PartNumber: CAS-D20TA; CompType: Switch; RoHS: Y
S5 = CMP-0002139-2: Switch, Slide, SPDT  100mA, SMT; Manufacturer: Copal Electronics; CurrentRating_mA: 100A; SwitchFunction: On-On; VDC_V: 6V; PositionCount: 1; ComponentLink1Description: Datasheet URL; LatestRevisionDate: 2017-03-09; PackageReference: Switch, 5.4x2.5x2.5mm; Publisher: Texas Instruments; Supplier 1: Digi-Key; Supplier Part Number 1: CAS120JCT-ND; MountType: SMT; Circuit: SPDT; Orientation: Top Actuated; PartNumber: CAS-120TA; CompType: Switch; RoHS: Y; ComponentLink1URL: http://copal-electronics.info/en/0008e/02462.pdf
U6 = CMP-0066458-2: 8-Bit Dual-Supply Bus Transceiver with Configurable Voltage-Level Shifting and Three-State Outputs, PW0024A (TSSOP-24); Alternate Manufacturer: Texas Instruments; SizeAreaWB_mm2: 82.32; SizeZ_mm: 1.2; SizeX_mm: 6.4; SizeY_mm: 7.8; SizeArea_mm2: 49.92; CompType: IC; AEC Category: Q200; AEC Qualified: N; Rating: Catalog; ComponentLink1URL: http://www.ti.com/lit/ds/symlink/sn74lvc8t245.pdf; PackageDescription: TSSOP-24; RoHS: Y; MountType: SMT; Manufacturer: Texas Instruments; PackageReference: PW0024A; PartNumber: SN74LVC8T245PW; ComponentLink1Description: Datasheet Link; ComponentLink2Description: Product Folder; ComponentLink2URL: http://www.ti.com/product/sn74lvc8t245; ComponentLink3Description: Online Datasheet; ComponentLink3URL: http://www.ti.com/product/sn74lvc8t245/datasheet; Operating Temperature Range: -40 to 85 C
U7 = CMP-0089841-1: 3 Circuit IC Switch 2:1 75Ohm 16-TSSOP; Manufacturer: Texas Instruments; TaMax_C: +85°C; Max Supply Voltage: 5.5V; PositionCount: 3; AEC Qualified: No; SizeZ_mm: 1.2mm; Standoff Height: 0.05mm; On State Resistance: 100-225Ω; Min Supply Voltage: 2V; -3Db Bandwith: 50MHz; Nominal Supply Current: 20uA; TaMin_C: -40°C; Lead Free: Yes; Operating Temperature Range: -40°C to +85°C; Mux Demux Ratio: 2:1; ComponentLink1Description: Datasheet; Part Number: SN74LV4053APWR; Digikey Description: IC MUX/DEMUX TRIPLE 2X1 16TSSOP; ComponentLink1URL: https://upverter.com/datasheet/3a9d815208c4051a64f1f6fd539a8c5a24990e71.pdf; PartNumber: SN74LV4053APWR; Mouser Description: Multiplexer Switch ICs Triple 2-Ch Analog; Mouser Part Number: 595-SN74LV4053APWR; RoHS: TRUE; PackageReference: TSSOP16; helpURL: https://upverter.com/upn/revision/43c5e7c12a31b2aa/; datasheet: https://upverter.com/datasheet/3a9d815208c4051a64f1f6fd539a8c5a24990e71.pdf; Digikey Part Number: 296-3833-1-ND; Datasheet Path: datasheets/IC-SN74LV4053APWR.pdf
U8 U9 = CMP-0067418-1: DUAL 10-Ohm SPDT ANALOG SWITCH, DGS0010A (VSSOP-10); Alternate PartNumber: TS5A23157DGST; Alternate Manufacturer: Texas Instruments; Green_Lifecycle: Active; SizeAreaWB_mm2: 23.6; Green_REACh: Passed; U/M: EA; SizeZ_mm: 1.1; SizeX_mm: 4.9; SizeY_mm: 3.0; SizeArea_mm2: 14.7; CompType: IC; ComponentLink1URL: http://www.ti.com/lit/ds/symlink/ts5a23157.pdf; Publisher: Texas Instruments; PackageDescription: VSSOP-10; RoHS: Y; Footprint Path 6: C:\AltiumLibraries\Footprints\TI\.PcbLib; MountType: SMT; Green_EU RoHS-2: Passed; Manufacturer: Texas Instruments; Green_EU RoHS: Passed; PackageReference: DGS0010A; LatestRevisionDate: 2017-06-09; PartNumber: TS5A23157DGSR; ComponentLink1Description: Datasheet Link
U15 = CMP-0051789-2: Dual Buffer/Driver with Open-Drain Output, DBV0006A, LARGE T&R; Manufacturer: Texas Instruments; VCC(Min)(V): 1.65; VCC(Max)(V): 5.5; Output Type: CMOS; ICC @ Nom Voltage(Max)(mA): 0.01; Input Type: CMOS/TTL; Bits(#): 2; F @ Nom Voltage(Max)(Mhz): 150; Rating: Catalog; Technology Family: LVC; Voltage(Nom)(V): 1.8,2.5,3.3,5; Schmitt Trigger: No; Output Drive (IOL/IOH)(Max)(mA): 32/-32; tpd @ Nom Voltage(Max)(ns): 8.6,4.4,3.7,2.9; Logic: True; Sub-Family: Inverting Buffer/Driver; AEC Category: Q200; AEC Qualified: N; CompType: IC; Green_Lifecycle: Active; Green_REACh: Passed; SizeArea_mm2: 8.12; SizeAreaWB_mm2: 14.82; SizeX_mm: 2.8; SizeY_mm: 2.9; SizeZ_mm: 1.45; DatasheetVersion: SCES308K; PackageReference: DBV0006A; Generic Part Number: SN74LVC2G07; Operating Temperature Range(C): -40 to 125; 3-State Output: No; ComponentLink1Description: Datasheet Link; ComponentLink1URL: http://www.ti.com/lit/ds/symlink/sn74lvc2g07.pdf; ComponentLink2Description: Product Folder; ComponentLink2URL: http://www.ti.com/product/sn74lvc2g07; ComponentLink3Description: Online Datasheet; ComponentLink3URL: http://www.ti.com/product/sn74lvc2g07/datasheet; Green_EU RoHS-2: Passed; Green_EU RoHS: Passed; MountType: SMT; PackageDescription: SOT-23-6; PartNumber: SN74LVC2G07DBVR; RoHS: Y
Y1 = CMP-0093781-1: 20 MHz ±10ppm Crystal 8pF 50 Ohms 4-SMD, No Lead; Manufacturer: Wurth Electronics; SizeZ_mm: 0.8mm; Frequency Stability: 20ppm; Esr: 50; Frequency_Fixed: 20MHz; Digikey Part Number: 1923-830108207209CT-ND; Supplier 2: Mouser; Digikey Description: WE-XTAL QUARTZ CRYSTAL 20.0 MHZ;; Mouser Part Number: 710-830108207209; RoHS: TRUE; ComponentLink1Description: Datasheet; Datasheet Path: datasheets/Crys-830108207209.pdf; PartNumber: 830108207209; ComponentLink1URL: https://www.we-online.com/catalog/datasheet/830108207209.pdf; datasheet: https://www.we-online.com/catalog/datasheet/830108207209.pdf; Supplier 1: Digikey; Supplier Part Number 2: 710-830108207209; PackageReference: SMT_CRYSTAL_3MM2_2MM5; Tolerance_%: 10ppm; helpURL: https://upverter.com/upn/revision/d6d0562c8c37b931/; Supplier Part Number 1: 1923-830108207209CT-ND; Load Capacitance: 8pF; AEC Qualified: No; Lead Free: Yes; Operating Temperature Range: -40°C to +85°C; Part Number: 830108207209; Series: CFPX-180; Frequency Tolerance: 10ppm

## Sheet MCU152A_F28E12X_Device.SchDoc
size 431 x 279 mm; Date: Not shown in title block; ApprovedBy: Not shown in title block; CheckedBy: Not shown in title block; Author: Not shown in title block; CompanyName: Not shown in title block; Engineer: Not shown in title block; Organization: Not shown in title block; Address1: Not shown in title block; Address2: Not shown in title block; Address3: Not shown in title block; Address4: Not shown in title block; DocumentNumber: 4; Revision: Use project parameter SCH_Rev; SheetNumber: 4; SheetTotal: 8; PageSetup: Record=PageOptions|CenterHorizontal=True|CenterVertical=True|PrintScale=1.00|XCorrection=1.00|YCorrection=1.00|PrintKind=0|BorderSize=5000000|LeftOffset=0|BottomOffset=0|Orientation=2|PaperLength=1000|PaperWidth=1000|Scale=100|PaperSource=15|PrintQuality=600|MediaType=1|DitherType=10|PaperKind=Letter|PrintScaleMode=1; Orderable: LAUNCHXL-F2800157; CurrentTime: Not shown in title block; CurrentDate: Not shown in title block; Time: Not shown in title block; DocumentFullPathAndName: Not shown in title block; DocumentName: Not shown in title block; ModifiedDate: Not shown in title block; ImagePath: Not shown in title block
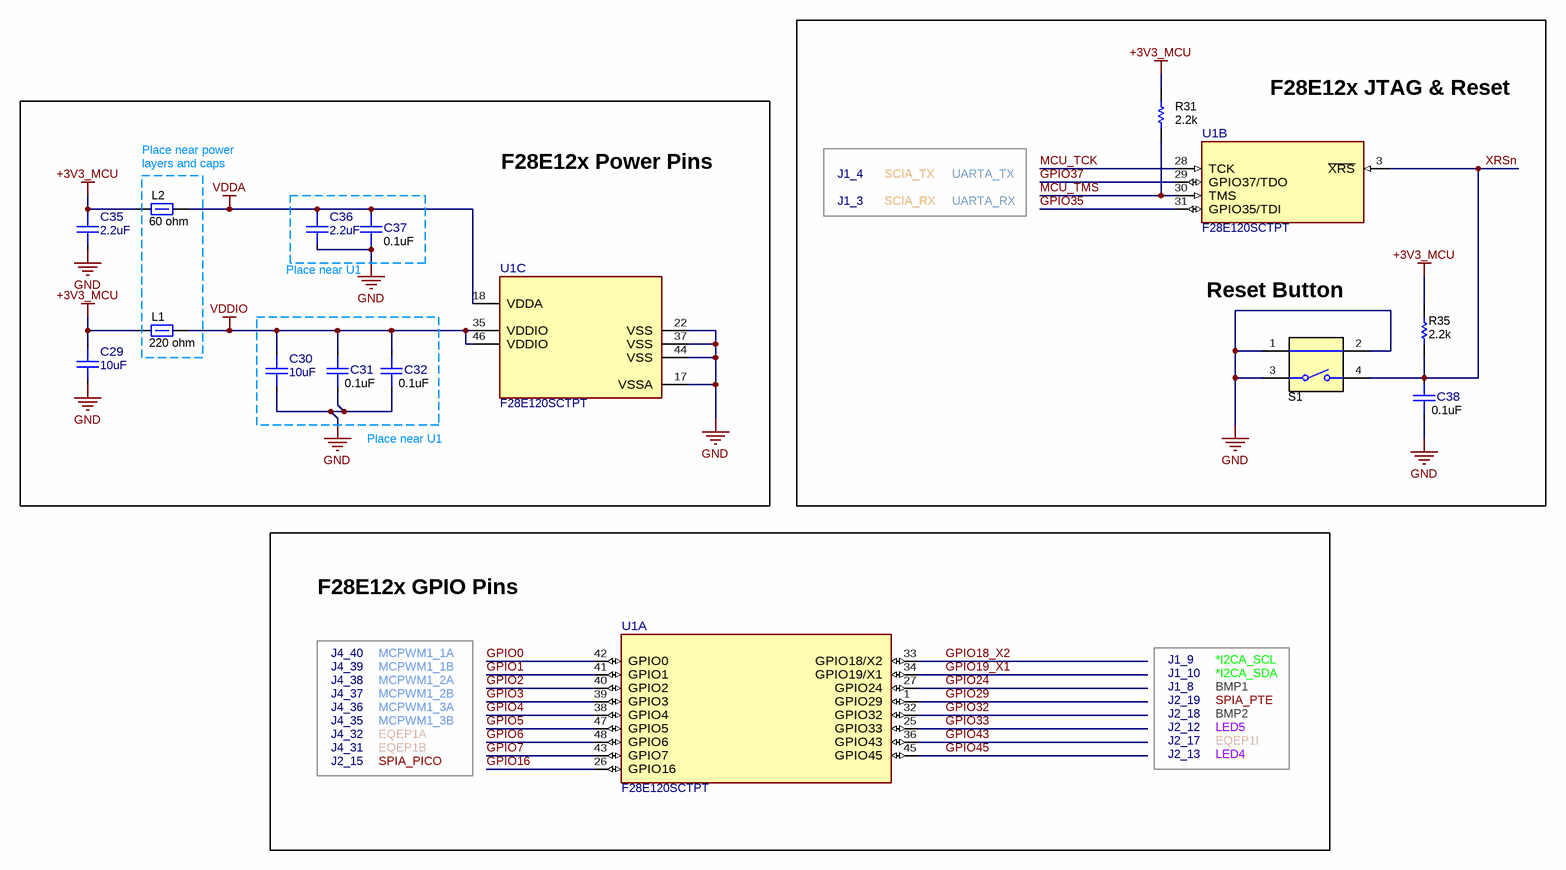
[diagram p3: MCU152A_F28E12X_Device.SchDoc]

### Parts
C29  ValueDisplayed: 10uF  [FP-885012106031_0603-MFG]  (hidden comment: 885012106031)
C30  ValueDisplayed: 10uF  [FP-885012106031_0603-MFG]  (hidden comment: 885012106031)
C31  ValueDisplayed: 0.1uF  [FP-885012205018_0402-MFG]  (hidden comment: 885012205018)
C32  ValueDisplayed: 0.1uF  [FP-885012205018_0402-MFG]  (hidden comment: 885012205018)
C35  ValueDisplayed: 2.2uF  [FP-885012106011_0603-MFG]  (hidden comment: 885012106011)
C36  ValueDisplayed: 2.2uF  [FP-885012106011_0603-MFG]  (hidden comment: 885012106011)
C37  ValueDisplayed: 0.1uF  [FP-885012205018_0402-MFG]  (hidden comment: 885012205018)
C38  ValueDisplayed: 0.1uF  [FP-885012205018_0402-MFG]  (hidden comment: 885012205018)
L1  ValueDisplayed: 220 ohm  [0805_HV]  (hidden comment: 742792022)
L2  value 60 ohm  [0805_HV]  (hidden comment: 742792063)
R31  ValueDisplayed: 2.2k  [0402]  (hidden comment: CRCW04022K20JNED)
R35  ValueDisplayed: 2.2k  [0402]  (hidden comment: CRCW04022K20JNED)
S1  1188E-1K2-V-TR  [SW_1188E]  (value not drawn)
U1  F28E120SCTPT  [PT0048A-MFG]  (parts A,B,C of 4)

### Blocks framed on the sheet
F28E12x Power Pins: C29-C32 C35-C37 L1 L2 U1
F28E12x GPIO Pins: U1

### Nets
+3V3_MCU: C29.1 C35.1 L1.1 L2.1 R31.2 R35.2
GND: C29.2 C30.2 C31.1 C32.1 C35.2 C36.2 C37.1 C38.1 S1.1 S1.2 S1.3 U1.17(VSSA) U1.22(VSS) U1.37(VSS) U1.44(VSS)
VDDA: C36.1 C37.2 L2.2 U1.18(VDDA)
VDDIO: C30.1 C31.2 C32.2 L1.2 U1.35(VDDIO) U1.46(VDDIO)
GPIO0: U1.42(GPIO0)
GPIO1: U1.41(GPIO1)
GPIO2: U1.40(GPIO2)
GPIO3: U1.39(GPIO3)
GPIO4: U1.38(GPIO4)
GPIO5: U1.47(GPIO5)
GPIO6: U1.48(GPIO6)
GPIO7: U1.43(GPIO7)
GPIO16: U1.26(GPIO16)
GPIO18_X2: U1.33(GPIO18/X2)
GPIO19_X1: U1.34(GPIO19/X1)
GPIO24: U1.27(GPIO24)
GPIO29: U1.1(GPIO29)
GPIO32: U1.32(GPIO32)
GPIO33: U1.25(GPIO33)
GPIO35: U1.31(GPIO35/TDI)
GPIO37: U1.29(GPIO37/TDO)
GPIO43: U1.36(GPIO43)
GPIO45: U1.45(GPIO45)
MCU_TCK: U1.28(TCK)
MCU_TMS: R31.1 U1.30(TMS)
XRSn: C38.2 R35.1 S1.4 U1.3(~{XRS})

### Notes on the sheet
- F28E12x JTAG & Reset
- (near L2) layers and caps
- Place near power
- J1_4
- J1_3
- SCIA_RX
- SCIA_TX
- UARTA_TX
- UARTA_RX
- Place near U1
- Reset Button
- J4_40
- J4_39
- J4_38
- J4_37
- MCPWM1_1A
- MCPWM1_1B
- MCPWM1_2A
- MCPWM1_2B
- J1_9
- J1_10
- J1_8
- J2_19
- *I2CA_SCL
- *I2CA_SDA
- SPIA_PTE
- BMP1
- J4_36
- J4_35
- J4_32
- J4_31
- J2_15
- SPIA_PICO
- EQEP1A
- EQEP1B
- MCPWM1_3A
- MCPWM1_3B
- J2_18
- J2_12
- J2_17
- J2_13
- BMP2
- LED5
- EQEP1I
- LED4
- Drawn By:
- SVN Rev:
- Number:
- TID #:
- Orderable:
- Rev:
- Sheet Title:
- File:
- Project Title:
- Designed for:
- Assembly Variant:
- Mod. Date:
- Sheet:
- Size:
- of
- B
- http://www.ti.com
- Texas Instruments and/or its licensors do not warrant the accuracy or completeness of this specification or any information contained therein. Texas Instruments and/or its licensors do not warrant that this design will meet the specifications, will be suitable for your application or fit for any particular purpose, or will operate in an implementation. Texas Instruments and/or its licensors do not warrant that the design is production worthy. You should completely validate and test your design implementation to confirm the system functionality for your application.
- Engineer:
- Contact:
- © Texas Instruments

### Library data of the parts
C29 C30 = CMP-0124926-1: 10 µF ±20% 25V Ceramic Capacitor X5R 0603 (1608 Metric); Manufacturer: Wurth; AEC Qualified: No; Cap_F: 10µF; SizeZ_mm: 1mm; TempCo: 15%; Value: 10µF; PackageReference: 0603; PartNumber: 885012106031; RoHS: TRUE; Tolerance_%: 20%; VDC_V: 25V; Part Number: 885012106031; datasheet: https://www.we-online.com/katalog/datasheet/885012106031.pdf; Datasheet Path: datasheets/Cap-885012106031.pdf; helpURL: https://upverter.com/upn/revision/3eb71e8268f7dbaa/; Lead Free: Yes; Operating Temperature Range: -55°C to +85°C; Temperature Characteristic: X5R; ComponentLink1Description: Datasheet; ComponentLink1URL: https://www.we-online.com/katalog/datasheet/885012106031.pdf
C31 C32 C37 C38 = CMP-0090362-1: as C5 on sheet MCU152A_AltRouting_Misc; RoHS: TRUE; Tolerance_%: 10%; datasheet: https://www.we-online.com/catalog/datasheet/885012205018.pdf; Lead Free: Yes; Operating Temperature Range: -55°C to +125°C; ComponentLink1Description: Datasheet; Digikey Description: CAP CER 0.1UF 10V X7R 0402; Supplier Part Number 1: 732-7513-1-ND; Supplier 2: Mouser; Mouser Part Number: 710-885012205018; Digikey Part Number: 732-7513-1-ND; Temperature Characteristic: X7R; Supplier 1: Digikey; Datasheet Path: datasheets/Cap-885012205018.pdf; ComponentLink1URL: https://www.we-online.com/catalog/datasheet/885012205018.pdf; VDC_V: 10V; Supplier Part Number 2: 710-885012205018; Cap_F: 100nF; PackageReference: 0402; PartNumber: 885012205018; Part Number: 885012205018; helpURL: https://upverter.com/upn/revision/1acbe355db19639d/
C35 C36 = CMP-0124925-1: 2.2 µF ±20% 10V Ceramic Capacitor X5R 0603 (1608 Metric); Manufacturer: Wurth Electronics; AEC Qualified: No; Cap_F: 2.2µF; SizeZ_mm: 0.87mm; TempCo: 15%; Value: 2.2µF; PackageReference: 0603; PartNumber: 885012106011; RoHS: TRUE; Supplier 1: Digikey; Supplier 2: Mouser; Supplier Part Number 1: 732-7908-1-ND; Supplier Part Number 2: 710-885012106011; Tolerance_%: 20%; VDC_V: 10V; Part Number: 885012106011; datasheet: https://www.we-online.com/components/products/datasheet/885012106011.pdf; Datasheet Date: 2021-01-03; Datasheet Path: datasheets/Cap-885012106011.pdf; Datasheet Version: 002.000; Digikey Description: CAP CER 2.2UF 10V X5R 0603; Digikey Part Number: 732-7908-1-ND; helpURL: https://upverter.com/upn/revision/043a68a068ea15af/; Lead Free: Yes; Mouser Part Number: 710-885012106011; Operating Temperature Range: -55°C to +85°C; Temperature Characteristic: X5R; ComponentLink1Description: Datasheet; ComponentLink1URL: https://www.we-online.com/components/products/datasheet/885012106011.pdf
L1 = CMP-0003073-1: Ferrite Bead, 220 ohm @ 100 MHz, 2 A, 0805; Manufacturer: Wurth Elektronik; Ztyp@1GHz_Ohm: 190.289; ZTyp@100MHz_Ohm: 220; SizeAreaWB_mm2: 6.75; DCR_ohm: 0.05; Value1: 0.05 ohm; Value: 220 ohm; Imax_A: 2A; SizeZ_mm: 1.45; SizeX_mm: 2; SizeY_mm: 1.25; SizeArea_mm2: 2.5; ComponentLink1URL: http://katalog.we-online.de/pbs/datasheet/742792022.pdf; Supplier Part Number 2: 710-742792022; Publisher: Texas Instruments; Supplier 2: Mouser; Published: 2014-04-30; RoHS: Y; MountType: SMT; Supplier 1: Digi-Key; PackageReference: 0805; Value2: 2A; CompType: Ferrite Bead; LatestRevisionDate: 2017-03-09; PartNumber: 742792022; ComponentLink1Description: Datasheet link; Supplier Part Number 1: 732-1614-1-ND
L2 = CMP-0003093-1: Ferrite Bead, 60 ohm @ 100 MHz, 3 A, 0805; Manufacturer: Wurth Elektronik; Ztyp@1GHz_Ohm: 95.384; ZTyp@100MHz_Ohm: 60; SizeAreaWB_mm2: 6.75; DCR_ohm: 0.025; Value1: 0.025 ohm; Imax_A: 3A; SizeZ_mm: 1.45; SizeX_mm: 2; SizeY_mm: 1.25; SizeArea_mm2: 2.5; ComponentLink1URL: http://katalog.we-online.de/pbs/datasheet/742792063.pdf; Supplier Part Number 2: 710-742792063; Publisher: Texas Instruments; Supplier 2: Mouser; Published: 2014-04-30; RoHS: Y; MountType: SMT; Supplier 1: Digi-Key; PackageReference: 0805; Value2: 3A; CompType: Ferrite Bead; LatestRevisionDate: 2017-03-09; PartNumber: 742792063; ComponentLink1Description: Datasheet link; Supplier Part Number 1: 732-1612-1-ND; ValueDisplayed: 60 ohm
R31 R35 = CMP-0026890-5: RES, 2.2 k, 5%, 0.063 W, AEC-Q200 Grade 0, 0402; Manufacturer: Vishay-Dale; Value: 2.2k; Value_Code: 2k20; Power_W: 63mW; Value2: 0.063W; VDC_V: 50V; TempCo: 200 ppm/C; EIA_Code: E24; AEC Category: Q200; AEC Qualified: Y; AEC Grade: 0; SizeArea_mm2: 0.5; SizeX_mm: 1; SizeZ_mm: 0.6; CompType: Resistor; PartNumber: CRCW04022K20JNED; PackageReference: 0402; RoHS: E; Res_ohm: 2.2k; Tolerance_%: 5%; Value1: 5%; MountType: SMT; Technology: Thick Film; ComponentLink1Description: Datasheet link; ComponentLink1URL: http://www.vishay.com/docs/20035/dcrcwe3.pdf; Supplier 1: Digi-Key; Supplier Part Number 1: 541-2.2KJCT-ND; Supplier 2: Newark; Supplier Part Number 2: 59M6710; Supplier 3: Mouser; Supplier Part Number 3: 71-CRCW0402J-2.2K-E3; SizeY_mm: 0.5
S1 = CMP-0002328-1: Switch, SPST, 0.05 A, 12 VDC, SMD; Manufacturer: Diptronics; SizeAreaWB_mm2: 53.9; SizeArea_mm2: 27.3; SizeX_mm: 7.8; SizeY_mm: 3.5; VDC_V: 12V; PositionCount: 1; CurrentRating_mA: 50A; PartNumber: 1188E-1K2-V-TR; MountType: SMT; SizeZ_mm: 3.5; ComponentLink1Description: Datasheet URL; ComponentLink1URL: http://www.dip.com.tw/en/en-product-information/en-switch004/item/download/1976_b080c057386714e3a6604cbe658b9df3; RoHS: Y; Circuit: SPST; Orientation: Side Actuated; CompType: Switch; PackageReference: 7.8x3.5mm; Publisher: Texas Instruments; LatestRevisionDate: 2017-03-09
U1 = CMP-0125361-1: F28E12x Real-Time Microcontrollers; Manufacturer: Texas Instruments; SizeZ_mm: 1.6mm; Core Architecture: C28x; Data Bus Width: 32bits; Frequency_Fixed: 160MHz; Interface: I2C,SPI,UART,SCI; Max Supply Voltage: 3.63V; Memory Size: 128KBytes; Memory Type: FLASH; Min Supply Voltage: 2.8V; Number Of A/D Converters: 1; Number Of Adc Channels: 9; Number Of I/Os: 27; Number Of Pwm Channels: 8; Number Of Timers/Counters: 4; Number Of Uart Channels: 2; Ram Size: 16KBytes; Standoff Height: 0.05mm; TJmax_C: +125°C; PackageReference: LQFP48; PartNumber: F28E120SCTPT; RoHS: UNKNOWN; Operating Temperature Range: -40°C to +125°C; Part Number: F28E120SCTPT; Datasheet Path: datasheets/IC-F28E120SCTPT.pdf; helpURL: https://upverter.com/upn/revision/b1ad6dff89e73838/; Number Of Cores: 1; Number Of I2C Channels: 1; Number Of Spi Channels: 1; PartId: 1